# Altium project Optional.PrjPCB
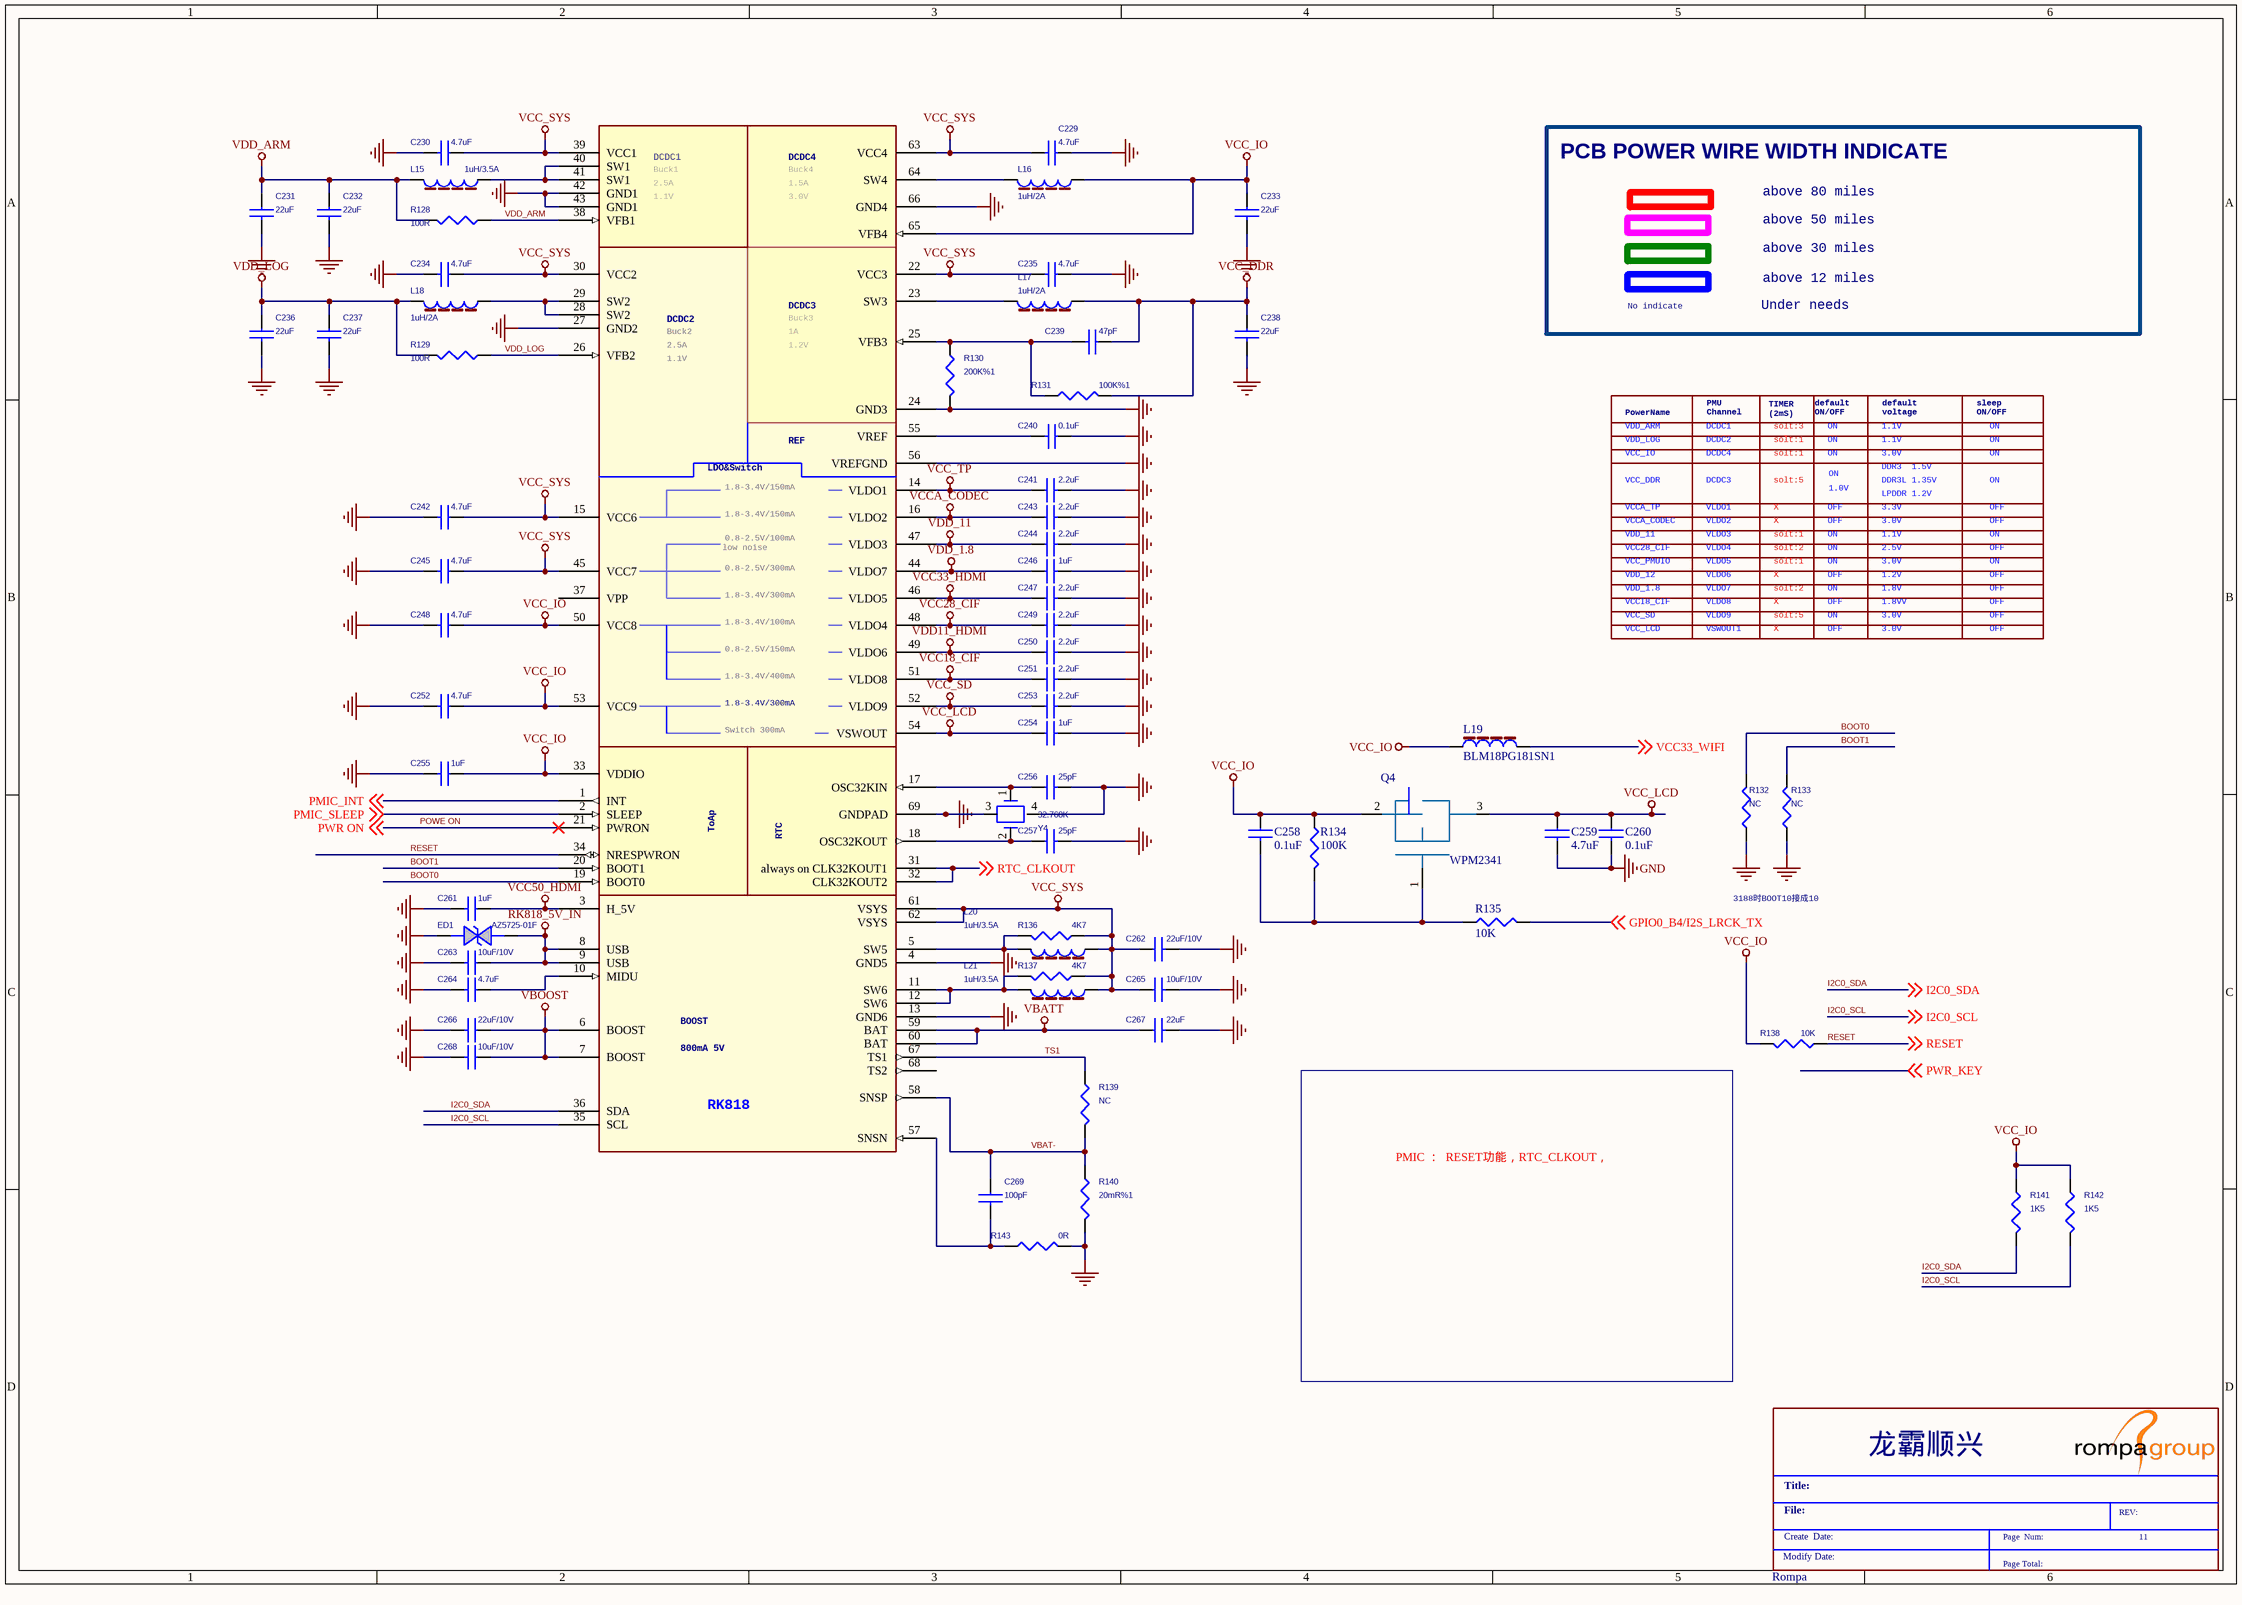
[diagram p0: Option_PMIC_RK818.SchDoc]
3 sheets, 116 parts. Net scope: global (net labels, ports and power ports of the same name join across sheets).
Sheets:
  Option_PMIC_RK818.SchDoc
  Option_LPDDR2-32_168_BGA134.SchDoc
  Option_PMIC_RK816.SchDoc

## Sheet Option_PMIC_RK818.SchDoc
size 420 x 297 mm

### Parts
(Parts that share a designator on the sheet are numbered #1, #2 ... from top to bottom, then left to right.)
*#1  Rompa  Schematic Page Number: 11  (graphical)
C229  4.7uF  [C0603]
C230  4.7uF  [C0603]
C231  22uF  [C0805]
C232  22uF  [C0805]
C233  22uF  [C0805]
C234  4.7uF  [C0603]
C235  4.7uF  [C0603]
C236  22uF  [C0805]
C237  22uF  [C0805]
C238  22uF  [C0805]
C239  47pF  [C0402]
C240  0.1uF  [C0402]
C241  2.2uF  [C0402]
C242  4.7uF  [C0603]
C243  2.2uF  [C0402]
C244  2.2uF  [C0402]
C245  4.7uF  [C0603]
C246  1uF  [C0402]
C247  2.2uF  [C0402]
C248  4.7uF  [C0603]
C249  2.2uF  [C0402]
C250  2.2uF  [C0402]
C251  2.2uF  [C0402]
C252  4.7uF  [C0603]
C253  2.2uF  [C0402]
C254  1uF  [C0402]
C255  1uF  [C0402]
C256  25pF  [C0402]
C257  25pF  [C0402]
C258  0.1uF  [C0402]
C259  4.7uF  [C0402]
C260  0.1uF  [C0402]
C261  1uF  [C0402]
C262  22uF/10V  [C1206]
C263  10uF/10V  [C0805]
C264  4.7uF  [C0603]
C265  10uF/10V  [C0805]
C266  22uF/10V  [C1206]
C267  22uF  [C0805]
C268  10uF/10V  [C0805]
C269  100pF  [C0402]
ED1  AZ5725-01F  [E0402]
L15  1uH/3.5A  [IND-4X4]
L16  1uH/2A  [IND-3X3]
L17  1uH/2A  [IND-3X3]
L18  1uH/2A  [IND-3X3]
L19  BLM18PG181SN1  [L0603]
L20  1uH/3.5A  [IND-4X4]
L21  1uH/3.5A  [IND-4X4]
Q4  WPM2341  [SOT23]
R128  100R  [R0402]
R129  100R  [R0402]
R130  200K%1  [R0402]
R131  100K%1  [R0402]
R132  NC  [R0402]
R133  NC  [R0402]
R134  100K  [R0402]
R135  10K  [R0402]
R136  4K7  [R0402]
R137  4K7  [R0402]
R138  10K  [R0402]
R139  NC  [R0402]
R140  20mR%1  [R1210]
R141  1K5  [R0402]
R142  1K5  [R0402]
R143  0R  [R0402]
U19  RK818  [QFN68]  (value not drawn)
Y4  32.768K  [CRY_MC146]

### Nets
GND: C229.1 C230.2 C231.2 C232.2 C233.2 C234.2 C235.1 C236.2 C237.2 C238.2 C240.1 C241.2 C242.2 C243.2 C244.2 C245.2 C246.2 C247.2 C248.2 C249.2 C250.2 C251.2 C252.2 C253.2 C254.2 C255.2 C256.2 C257.2 C259.2 C260.2 C261.2 C262.2 C263.2 C264.2 C265.2 C266.2 C267.2 C268.2 ED1.1 R130.1 R132.2 R133.2 R140.2 R143.2 U19.4(GND5) U19.13(GND6) U19.24(GND3) U19.27(GND2) U19.42(GND1) U19.43(GND1) U19.56(VREFGND) U19.66(GND4) U19.69(GNDPAD) Y4.3 Y4.4
RK818_5V_IN: C263.1 ED1.2 U19.8(USB) U19.9(USB)
VBATT: C267.1 U19.59(BAT) U19.60(BAT)
VBOOST: C266.1 C268.1 U19.6(BOOST) U19.7(BOOST)
VCC18_CIF: C251.1 U19.51(VLDO8)
VCC28_CIF: C249.1 U19.48(VLDO4)
VCC33_HDMI: C247.1 U19.46(VLDO5)
VCC50_HDMI: C261.1 U19.3(H_5V)
VCC_DDR: C238.1 C239.1 L17.2 R131.1
VCC_IO: C233.1 C248.1 C252.1 C255.1 C258.1 L16.2 L19.1 R134.1 R138.1 R141.1 R142.1 U19.33(VDDIO) U19.50(VCC8) U19.53(VCC9) U19.65(VFB4)
VCC_LCD: C254.1 C259.1 C260.1 U19.54(VSWOUT)
VCC_SD: C253.1 U19.52(VLDO9)
VCC_SYS: C229.2 C230.1 C234.1 C235.2 C242.1 C245.1 C262.1 C265.1 L20.2 L21.2 R136.1 R137.1 U19.15(VCC6) U19.22(VCC3) U19.30(VCC2) U19.39(VCC1) U19.45(VCC7) U19.61(VSYS) U19.62(VSYS) U19.63(VCC4)
VCC_TP: C241.1 U19.14(VLDO1)
VCCA_CODEC: C243.1 U19.16(VLDO2)
VDD11_HDMI: C250.1 U19.49(VLDO6)
VDD_1.8: C246.1 U19.44(VLDO7)
VDD_11: C244.1 U19.47(VLDO3)
VDD_ARM: C231.1 C232.1 L15.1 R128.1 R128.2 U19.38(VFB1)
VDD_LOG: C236.1 C237.1 L18.1 R129.1 R129.2 U19.26(VFB2)
BOOT0: R132.1 U19.19(BOOT0)
BOOT1: R133.1 U19.20(BOOT1)
GPIO0_B4/I2S_LRCK_TX: R135.2 ; off-sheet GPIO0_B4/I2S_LRCK_TX
I2C0_SCL: R142.2 U19.35(SCL) ; off-sheet I2C0_SCL
I2C0_SDA: R141.2 U19.36(SDA) ; off-sheet I2C0_SDA
PMIC_INT: U19.1(INT) ; off-sheet PMIC_INT
PMIC_SLEEP: U19.2(SLEEP) ; off-sheet PMIC_SLEEP
POWE ON: U19.21(PWRON) ; off-sheet PWR ON  [also labelled PWR ON]
RESET: R138.2 U19.34(NRESPWRON) ; off-sheet RESET
RTC_CLKOUT: U19.31(always_on_CLK32KOUT1) U19.32(CLK32KOUT2) ; off-sheet RTC_CLKOUT
TS1: R139.1 U19.67(TS1)
VBAT-: C269.1 R139.2 R140.1 U19.58(SNSP)
VCC33_WIFI: L19.2 ; off-sheet VCC33_WIFI
NetC239_2: C239.2 R130.2 R131.2 U19.25(VFB3)
NetC240_2: C240.2 U19.55(VREF)
NetC256_1: C256.1 U19.17(OSC32KIN) Y4.1
NetC257_1: C257.1 U19.18(OSC32KOUT) Y4.2
NetC258_2: C258.2 Q4.1 R134.2 R135.1
NetC264_1: C264.1 U19.10(MIDU)
NetC269_2: C269.2 R143.1 U19.57(SNSN)
NetL15_2: L15.2 U19.40(SW1) U19.41(SW1)
NetL16_1: L16.1 U19.64(SW4)
NetL17_1: L17.1 U19.23(SW3)
NetL18_2: L18.2 U19.28(SW2) U19.29(SW2)
NetL20_1: L20.1 R136.2 U19.5(SW5)
NetL21_1: L21.1 R137.2 U19.11(SW6) U19.12(SW6)

Not connected (* = marked no-connect by the designer): Q4 2 3; U19 37(VPP) 68(TS2)

### Notes on the sheet
- PCB POWER WIRE WIDTH INDICATE
- above 30 miles
- above 50 miles
- above 80 miles
- No indicate
- Under needs
- above 12 miles
- VDD_ARM
- VCC_IO
- VDD_LOG
- PowerName
- PMU
  Channel
- DCDC4
- DCDC1
- DCDC2
- TIMER
  (2mS)
- solt:1
- solt:3
- default
  ON/OFF
- ON
- 1.1V
- default
  voltage
- 3.0V
- sleep
  ON/OFF
- VCC_DDR
- VCCA_TP
- VCCA_CODEC
- DCDC3
- VLDO2
- VLDO1
- solt:5
- X
- OFF
- 1.0V
- 3.3V
- DDR3  1.5V
- LPDDR 1.2V
- DDR3L 1.35V
- VDD_11
- VCC_PMUIO
- VCC28_CIF
- VDD_12
- VDD_1.8
- VLDO4
- VLDO5
- VLDO3
- VLDO7
- VLDO6
- solt:2
- 1.2V
- 1.8V
- 2.5V
- VCC_SD
- VCC_LCD
- VCCI8_CIF
- VSWOUT1
- VLDO8
- VLDO9
- 1.8VV
- 3188时BOOT10接成10
- (near U19) RK818
- PMIC ：  RESET功能，RTC_CLKOUT，
- (in symbol RK818_1) DCDC1; DCDC4; Buck1; Buck4; 2.5A; 1.5A; 1.1V; 3.0V; DCDC3; Buck3; DCDC2; Buck2; 1A; 1.2V; REF; LDO&Switch; 1.8-3.4V/150mA; 0.8-2.5V/100mA; low noise; 0.8-2.5V/300mA; 1.8-3.4V/300mA; 1.8-3.4V/100mA; 0.8-2.5V/150mA; 1.8-3.4V/400mA; Switch 300mA; ToAp; RTC; 800mA 5V
- (in symbol Rompa) 龙霸顺兴; Title:; File:; REV:; Create  Date:; Page  Num:; Modify Date:; Page Total:

### Library data of the parts
C229-C257 C261-C269 = CAP NP_4
C258-C260 = CAP NP
ED1 = DIODE BI-DIR TRIG: ESD
L15-L18 L20 L21 = INDUCTOR_2: ROOM: USB+5V
L19 = INDUCTOR_2
R128-R133 R136-R138 = RESISTOR_1: RES,thick film,47KOhm,+/-5%,1/16W,SMD0402
R134 R135 = RESISTOR
R139 R143 = RESISTOR_1: 贴片电阻; ROOM: USB+5V; MARK: 2K
R140 = RESISTOR_1: 贴片电阻; MARK: 2K; ROOM: USB+5V
R141 R142 = RES 1B: ROHS CHIP RES 4.7K 1/16W 5%
U19 = RK818_1
Y4 = CRYSTAL_0: Crystal,32.768KHz,+/-30ppm,12pF,MC146,-10°C ~ +60   °C; Part Type: 晶体类\无源晶体

## Sheet Option_LPDDR2-32_168_BGA134.SchDoc
size 420 x 297 mm
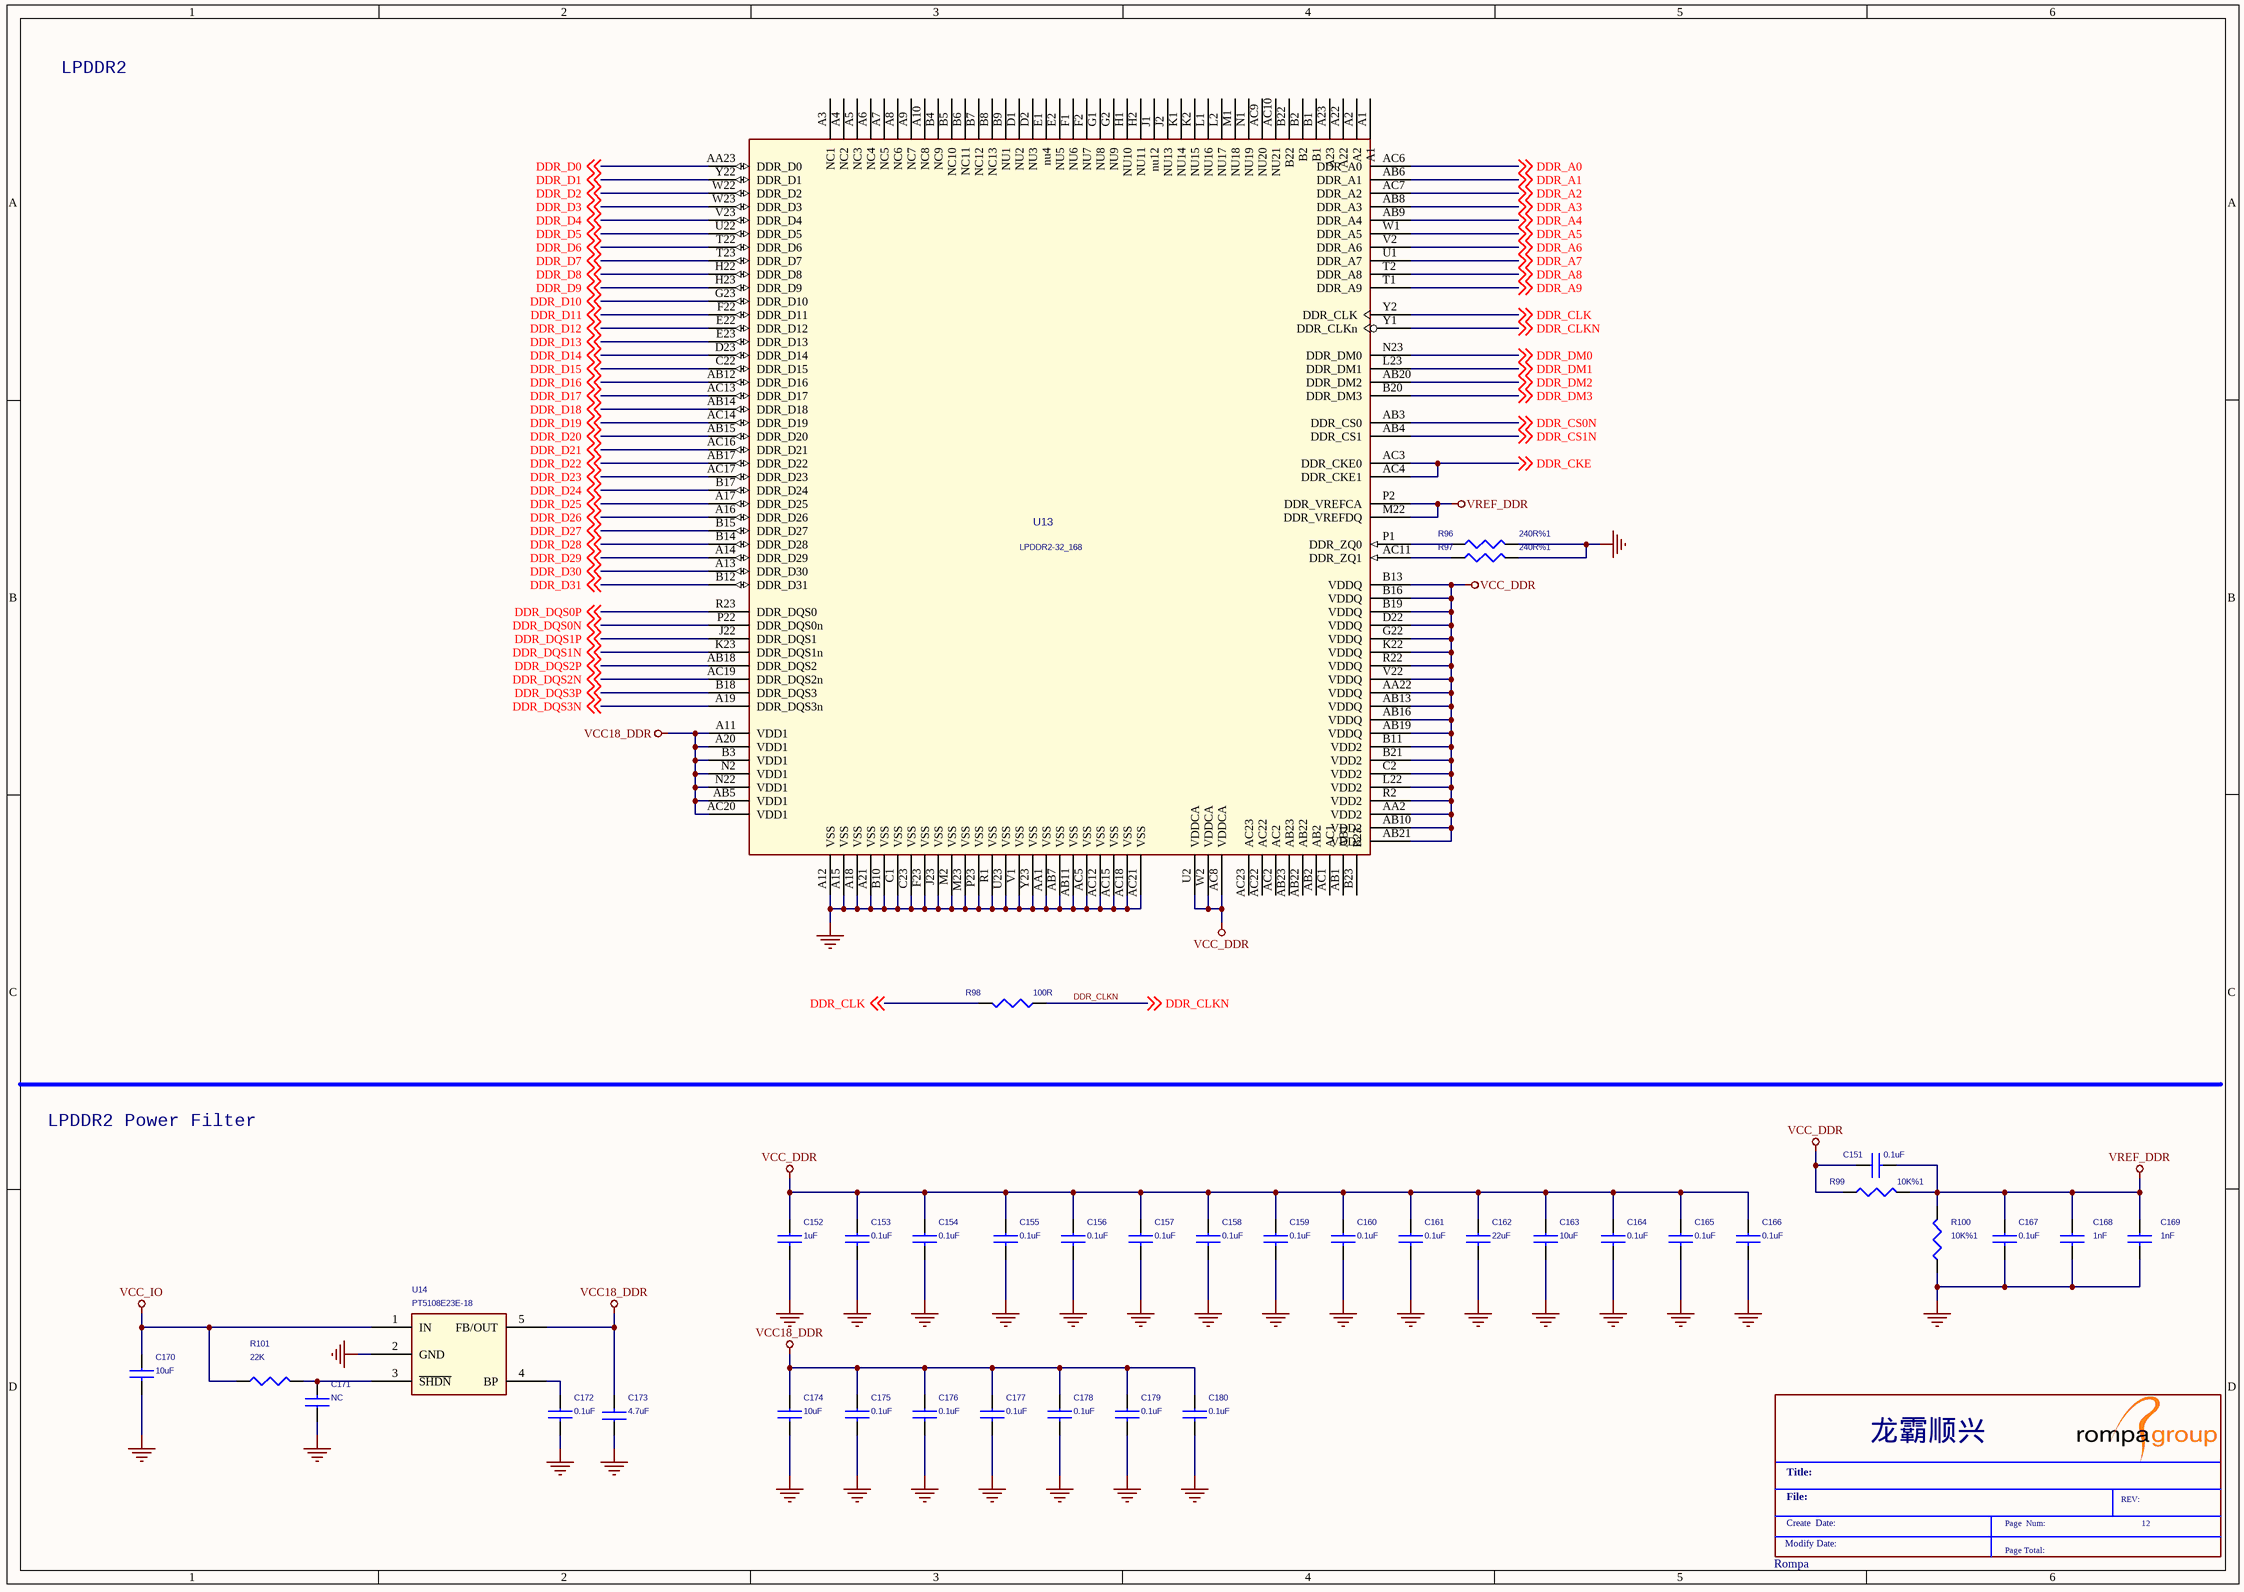
[diagram p1: Option_LPDDR2-32_168_BGA134.SchDoc]

### Parts
(Parts that share a designator on the sheet are numbered #1, #2 ... from top to bottom, then left to right.)
*#2  Rompa  Schematic Page Number: 12  (graphical)
C151  0.1uF  [C0402]
C152  1uF  [C0402]
C153  0.1uF  [C0402]
C154  0.1uF  [C0402]
C155  0.1uF  [C0402]
C156  0.1uF  [C0402]
C157  0.1uF  [C0402]
C158  0.1uF  [C0402]
C159  0.1uF  [C0402]
C160  0.1uF  [C0402]
C161  0.1uF  [C0402]
C162  22uF  [C0402]
C163  10uF  [C0402]
C164  0.1uF  [C0402]
C165  0.1uF  [C0402]
C166  0.1uF  [C0402]
C167  0.1uF  [C0402]
C168  1nF  [C0402]
C169  1nF  [C0402]
C170  10uF  [C0402]
C171  NC  [C0402]
C172  0.1uF  [C0402]
C173  4.7uF  [C0402]
C174  10uF  [C0402]
C175  0.1uF  [C0402]
C176  0.1uF  [C0402]
C177  0.1uF  [C0402]
C178  0.1uF  [C0402]
C179  0.1uF  [C0402]
C180  0.1uF  [C0402]
R96  240R%1  [R0402]
R97  240R%1  [R0402]
R98  100R  [R0402]
R99  10K%1  [R0402]
R100  10K%1  [R0402]
R101  22K  [R0402]
U13  LPDDR2-32_168  [BGA134]
U14  PT5108E23E-18  [SOT25]

### Nets
GND: C152.2 C153.2 C154.2 C155.2 C156.2 C157.2 C158.2 C159.2 C160.2 C161.2 C162.2 C163.2 C164.2 C165.2 C166.2 C167.2 C168.2 C169.2 C170.2 C171.1 C172.2 C173.1 C174.2 C175.2 C176.2 C177.2 C178.2 C179.2 C180.2 R96.2 R97.2 R100.1 U13.A12(VSS) U13.A15(VSS) U13.A18(VSS) U13.A21(VSS) U13.AA1(VSS) U13.AB7(VSS) U13.AB11(VSS) U13.AC5(VSS) U13.AC12(VSS) U13.AC15(VSS) U13.AC18(VSS) U13.AC21(VSS) U13.B10(VSS) U13.C1(VSS) U13.C23(VSS) U13.F23(VSS) U13.J23(VSS) U13.M2(VSS) U13.M23(VSS) U13.P23(VSS) U13.R1(VSS) U13.U23(VSS) U13.V1(VSS) U13.Y23(VSS) U14.2(GND)
VCC18_DDR: C173.2 C174.1 C175.1 C176.1 C177.1 C178.1 C179.1 C180.1 U13.A11(VDD1) U13.A20(VDD1) U13.AB5(VDD1) U13.AC20(VDD1) U13.B3(VDD1) U13.N2(VDD1) U13.N22(VDD1) U14.5(FB/OUT)
VCC_DDR: C151.1 C152.1 C153.1 C154.1 C155.1 C156.1 C157.1 C158.1 C159.1 C160.1 C161.1 C162.1 C163.1 C164.1 C165.1 C166.1 R99.1 U13.AA2(VDD2) U13.AA22(VDDQ) U13.AB10(VDD2) U13.AB13(VDDQ) U13.AB16(VDDQ) U13.AB19(VDDQ) U13.AB21(VDD2) U13.AC8(VDDCA) U13.B11(VDD2) U13.B13(VDDQ) U13.B16(VDDQ) U13.B19(VDDQ) U13.B21(VDD2) U13.C2(VDD2) U13.D22(VDDQ) U13.G22(VDDQ) U13.K22(VDDQ) U13.L22(VDD2) U13.R2(VDD2) U13.R22(VDDQ) U13.U2(VDDCA) U13.V22(VDDQ) U13.W2(VDDCA)
VCC_IO: C170.1 R101.1 U14.1(IN)
VREF_DDR: C151.2 C167.1 C168.1 C169.1 R99.2 R100.2 U13.M22(DDR_VREFDQ) U13.P2(DDR_VREFCA)
DDR_A0: U13.AC6(DDR_A0) ; off-sheet DDR_A0
DDR_A1: U13.AB6(DDR_A1) ; off-sheet DDR_A1
DDR_A2: U13.AC7(DDR_A2) ; off-sheet DDR_A2
DDR_A3: U13.AB8(DDR_A3) ; off-sheet DDR_A3
DDR_A4: U13.AB9(DDR_A4) ; off-sheet DDR_A4
DDR_A5: U13.W1(DDR_A5) ; off-sheet DDR_A5
DDR_A6: U13.V2(DDR_A6) ; off-sheet DDR_A6
DDR_A7: U13.U1(DDR_A7) ; off-sheet DDR_A7
DDR_A8: U13.T2(DDR_A8) ; off-sheet DDR_A8
DDR_A9: U13.T1(DDR_A9) ; off-sheet DDR_A9
DDR_CKE: U13.AC3(DDR_CKE0) U13.AC4(DDR_CKE1) ; off-sheet DDR_CKE
DDR_CLK: R98.2 U13.Y2(DDR_CLK) ; off-sheet DDR_CLK
DDR_CLKN: R98.1 U13.Y1(DDR_CLKn) ; off-sheet DDR_CLKN
DDR_CS0N: U13.AB3(DDR_CS0) ; off-sheet DDR_CS0N
DDR_CS1N: U13.AB4(DDR_CS1) ; off-sheet DDR_CS1N
DDR_D0: U13.AA23(DDR_D0) ; off-sheet DDR_D0
DDR_D1: U13.Y22(DDR_D1) ; off-sheet DDR_D1
DDR_D2: U13.W22(DDR_D2) ; off-sheet DDR_D2
DDR_D3: U13.W23(DDR_D3) ; off-sheet DDR_D3
DDR_D4: U13.V23(DDR_D4) ; off-sheet DDR_D4
DDR_D5: U13.U22(DDR_D5) ; off-sheet DDR_D5
DDR_D6: U13.T22(DDR_D6) ; off-sheet DDR_D6
DDR_D7: U13.T23(DDR_D7) ; off-sheet DDR_D7
DDR_D8: U13.H22(DDR_D8) ; off-sheet DDR_D8
DDR_D9: U13.H23(DDR_D9) ; off-sheet DDR_D9
DDR_D10: U13.G23(DDR_D10) ; off-sheet DDR_D10
DDR_D11: U13.F22(DDR_D11) ; off-sheet DDR_D11
DDR_D12: U13.E22(DDR_D12) ; off-sheet DDR_D12
DDR_D13: U13.E23(DDR_D13) ; off-sheet DDR_D13
DDR_D14: U13.D23(DDR_D14) ; off-sheet DDR_D14
DDR_D15: U13.C22(DDR_D15) ; off-sheet DDR_D15
DDR_D16: U13.AB12(DDR_D16) ; off-sheet DDR_D16
DDR_D17: U13.AC13(DDR_D17) ; off-sheet DDR_D17
DDR_D18: U13.AB14(DDR_D18) ; off-sheet DDR_D18
DDR_D19: U13.AC14(DDR_D19) ; off-sheet DDR_D19
DDR_D20: U13.AB15(DDR_D20) ; off-sheet DDR_D20
DDR_D21: U13.AC16(DDR_D21) ; off-sheet DDR_D21
DDR_D22: U13.AB17(DDR_D22) ; off-sheet DDR_D22
DDR_D23: U13.AC17(DDR_D23) ; off-sheet DDR_D23
DDR_D24: U13.B17(DDR_D24) ; off-sheet DDR_D24
DDR_D25: U13.A17(DDR_D25) ; off-sheet DDR_D25
DDR_D26: U13.A16(DDR_D26) ; off-sheet DDR_D26
DDR_D27: U13.B15(DDR_D27) ; off-sheet DDR_D27
DDR_D28: U13.B14(DDR_D28) ; off-sheet DDR_D28
DDR_D29: U13.A14(DDR_D29) ; off-sheet DDR_D29
DDR_D30: U13.A13(DDR_D30) ; off-sheet DDR_D30
DDR_D31: U13.B12(DDR_D31) ; off-sheet DDR_D31
DDR_DM0: U13.N23(DDR_DM0) ; off-sheet DDR_DM0
DDR_DM1: U13.L23(DDR_DM1) ; off-sheet DDR_DM1
DDR_DM2: U13.AB20(DDR_DM2) ; off-sheet DDR_DM2
DDR_DM3: U13.B20(DDR_DM3) ; off-sheet DDR_DM3
DDR_DQS0N: U13.P22(DDR_DQS0n) ; off-sheet DDR_DQS0N
DDR_DQS0P: U13.R23(DDR_DQS0) ; off-sheet DDR_DQS0P
DDR_DQS1N: U13.K23(DDR_DQS1n) ; off-sheet DDR_DQS1N
DDR_DQS1P: U13.J22(DDR_DQS1) ; off-sheet DDR_DQS1P
DDR_DQS2N: U13.AC19(DDR_DQS2n) ; off-sheet DDR_DQS2N
DDR_DQS2P: U13.AB18(DDR_DQS2) ; off-sheet DDR_DQS2P
DDR_DQS3N: U13.A19(DDR_DQS3n) ; off-sheet DDR_DQS3N
DDR_DQS3P: U13.B18(DDR_DQS3) ; off-sheet DDR_DQS3P
NetC171_2: C171.2 R101.2 U14.3(~{SHDN})
NetC172_1: C172.1 U14.4(BP)
NetR96_1: R96.1 U13.P1(DDR_ZQ0)
NetR97_1: R97.1 U13.AC11(DDR_ZQ1)

Not connected (* = marked no-connect by the designer): U13 A1 A2 A3(NC1) A4(NC2) A5(NC3) A6(NC4) A7(NC5) A8(NC6) A9(NC7) A10(NC8) A22 A23 AB1 AB2 AB22 AB23 AC1 AC2 AC9(NU20) AC10(NU21) AC22 AC23 B1 B2 B4(NC9) B5(NC10) B6(NC11) B7(NC12) B8(NC13) B9(NU1) B22 B23 D1(NU2) D2(NU3) E1(nu4) E2(NU5) F1(NU6) F2(NU7) G1(NU8) G2(NU9) H1(NU10) H2(NU11) J1(nu12) J2(NU13) K1(NU14) K2(NU15) L1(NU16) L2(NU17) M1(NU18) N1(NU19)

### Notes on the sheet
- LPDDR2
- LPDDR2 Power Filter
- (in symbol Rompa) 龙霸顺兴; Title:; File:; REV:; Create  Date:; Page  Num:; Modify Date:; Page Total:

### Library data of the parts
C151 C167-C169 = CAP NP_0
C152 C153 C174 = CAP NP: RoHS CHIP CAP 1uF +10/-10% X5R
C154-C166 C175-C180 = CAP NP: RoHS CHIP CAP 0.1uF +10/-10% X7R
C170 = CAP NP: CAP,MLCC,22uF,+/-10%,X5R,6.3V,SMD1206
C171 = CAP NP
C172 = CAP NP: CAP,MLCC,100nF,+/-10%,X7R,6.3V,SMD0402
C173 = CAP NP: CAP,MLCC,10uF,+/-10%,X5R,6.3V,SMD0805
R96 R97 R99 R100 = RESISTOR_0: 贴片电阻
R98 = RESISTOR: NC/ROHS CHIP RES 100R 1/16W 5%
R101 = RES 1B
U13 = LPDDR2-32_2
U14 = DS8008_4: LDO,PT5108E23E-18,VINmax=5.5V,Vout=1.8V,+/-2%,500mA,SOT-23-5

## Sheet Option_PMIC_RK816.SchDoc
size 297 x 209 mm
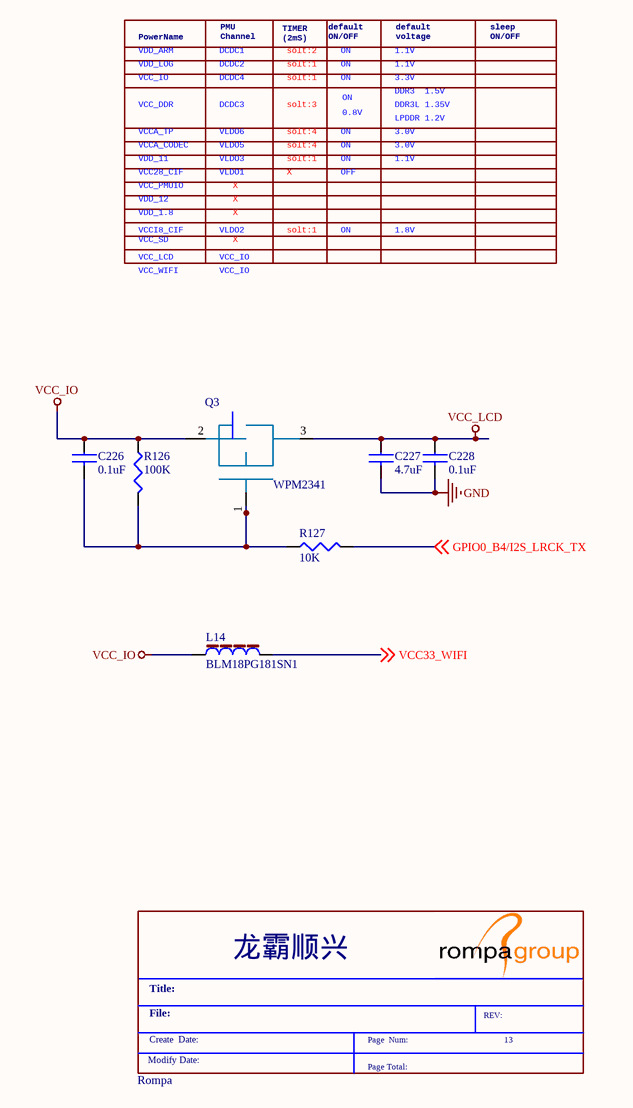
[diagram p2: Option_PMIC_RK816.SchDoc]

### Parts
(Parts that share a designator on the sheet are numbered #1, #2 ... from top to bottom, then left to right.)
*#3  Rompa  Schematic Page Number: 13  (graphical)
C226  0.1uF  [C0402]
C227  4.7uF  [C0402]
C228  0.1uF  [C0402]
L14  BLM18PG181SN1  [L0603]
Q3  WPM2341  [SOT23]
R126  100K  [R0402]
R127  10K  [R0402]

### Nets
GND: C227.2 C228.2
VCC_IO: C226.1 L14.1 R126.1
VCC_LCD: C227.1 C228.1
GPIO0_B4/I2S_LRCK_TX: R127.2 ; off-sheet GPIO0_B4/I2S_LRCK_TX
VCC33_WIFI: L14.2 ; off-sheet VCC33_WIFI
NetC226_2: C226.2 Q3.1 R126.2 R127.1

Not connected (* = marked no-connect by the designer): Q3 2 3

### Notes on the sheet
- VDD_ARM
- VCC_IO
- PowerName
- VDD_LOG
- DCDC4
- PMU
  Channel
- DCDC2
- DCDC1
- TIMER
  (2mS)
- solt:1
- solt:2
- default
  ON/OFF
- ON
- default
  voltage
- 1.1V
- DDR3  1.5V
- 3.3V
- sleep
  ON/OFF
- VCC_DDR
- VDD_11
- VCCA_TP
- VCCA_CODEC
- DCDC3
- VLDO3
- VLDO5
- VLDO6
- solt:3
- solt:4
- 0.8V
- 3.0V
- LPDDR 1.2V
- DDR3L 1.35V
- VCCI8_CIF
- VCC28_CIF
- VCC_PMUIO
- VDD_12
- VDD_1.8
- VLDO1
- VLDO2
- X
- OFF
- 1.8V
- VCC_LCD
- VCC_SD
- VCC_WIFI
- (in symbol Rompa) 龙霸顺兴; Title:; File:; REV:; Create  Date:; Page  Num:; Modify Date:; Page Total:

### Library data of the parts
C226-C228 = CAP NP
L14 = INDUCTOR_2
R126 R127 = RESISTOR

## Nets that join several sheets
GND: Option_PMIC_RK818 (55 pins), Option_LPDDR2-32_168_BGA134 (57 pins), Option_PMIC_RK816 (C227.2 C228.2)
VCC_DDR: Option_PMIC_RK818 (C238.1 C239.1 L17.2 R131.1), Option_LPDDR2-32_168_BGA134 (40 pins)
VCC_IO: Option_PMIC_RK818 (15 pins), Option_LPDDR2-32_168_BGA134 (C170.1 R101.1 U14.1), Option_PMIC_RK816 (C226.1 L14.1 R126.1)
VCC_LCD: Option_PMIC_RK818 (C254.1 C259.1 C260.1 U19.54), Option_PMIC_RK816 (C227.1 C228.1)
GPIO0_B4/I2S_LRCK_TX: Option_PMIC_RK818 (R135.2), Option_PMIC_RK816 (R127.2)
VCC33_WIFI: Option_PMIC_RK818 (L19.2), Option_PMIC_RK816 (L14.2)